# EAGLE design circuit (EAGLE 6.6.0)
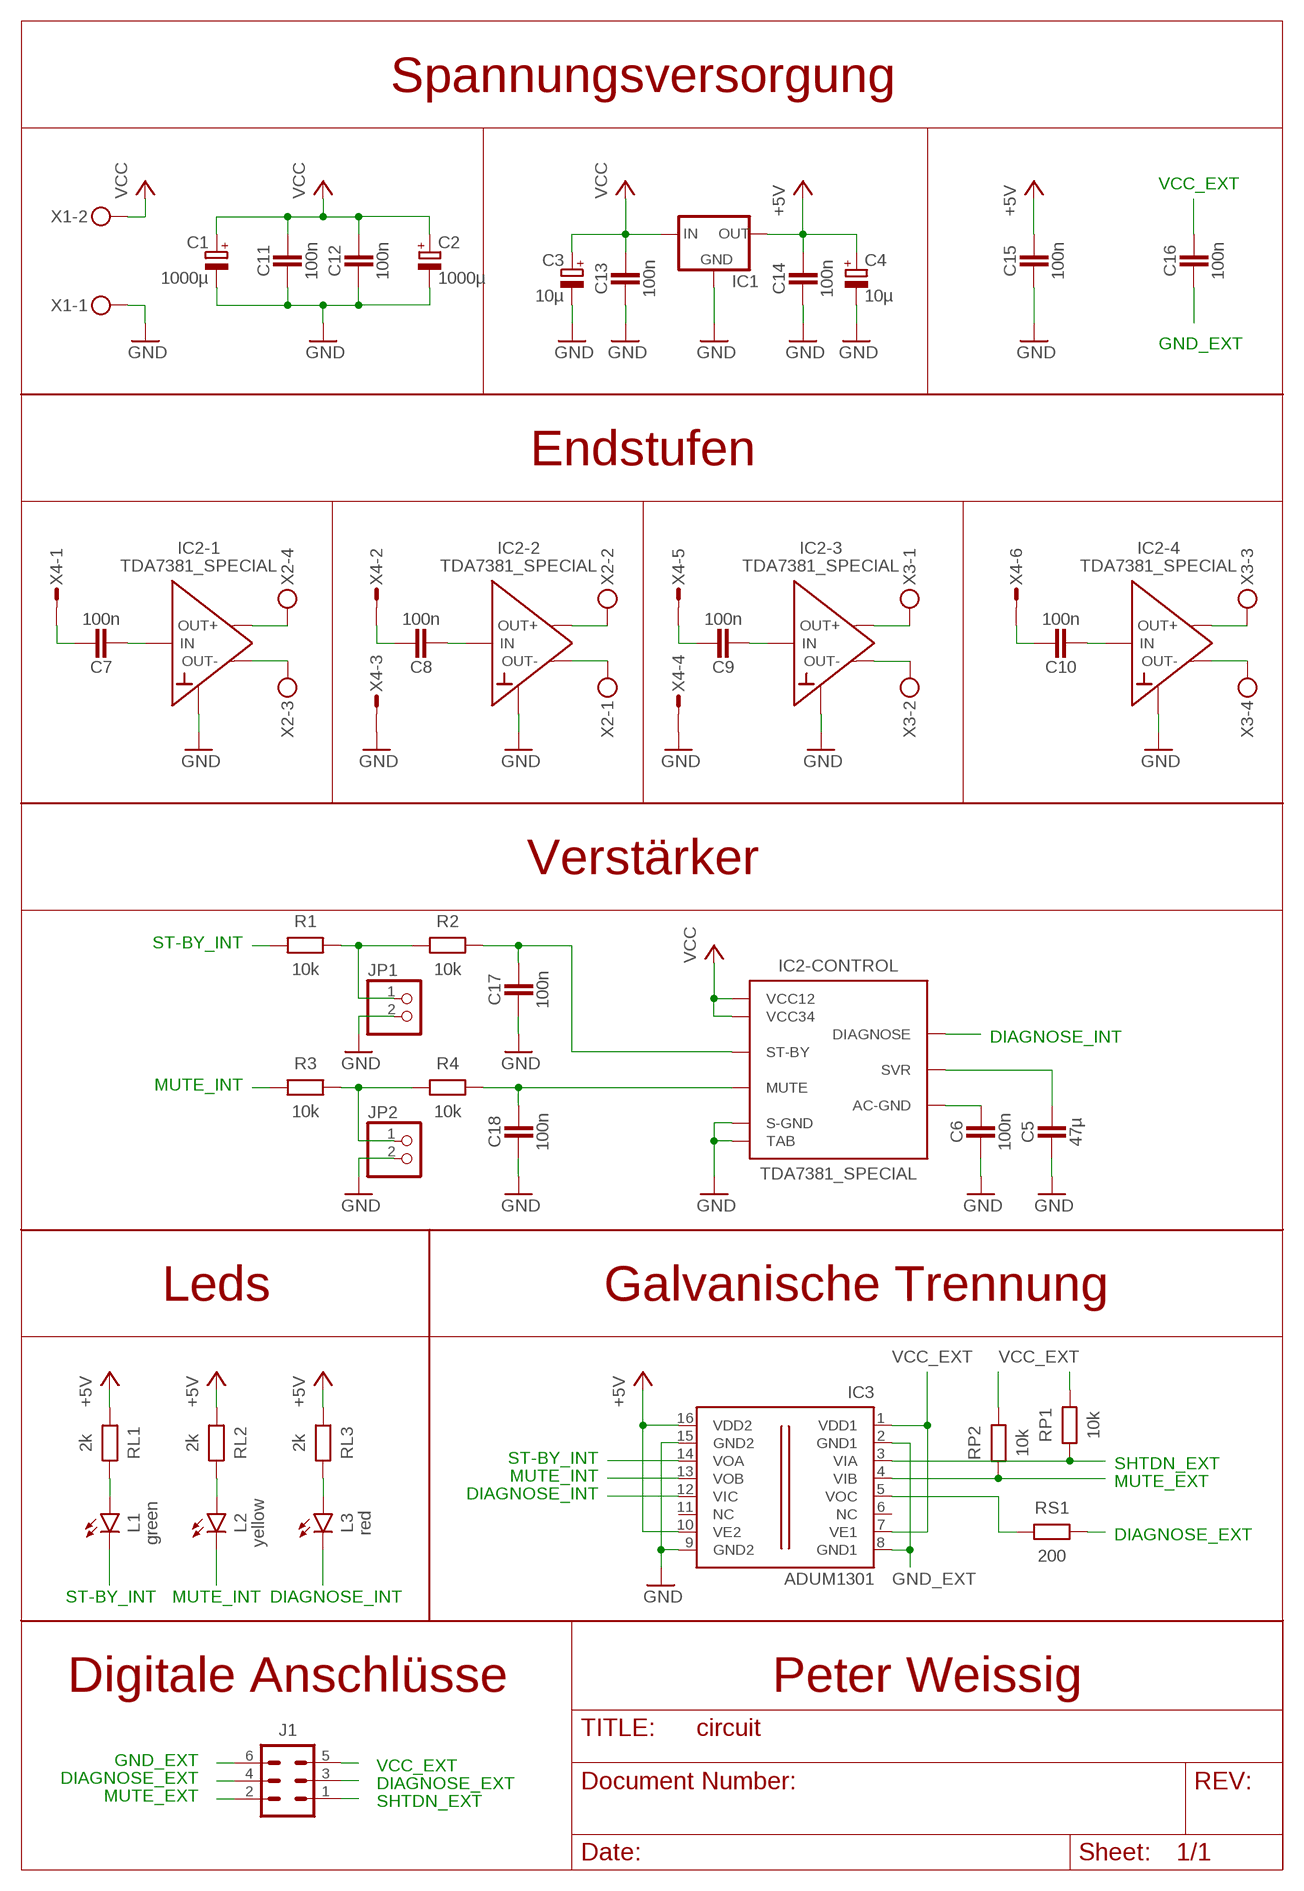
[diagram p0: schematic, sheet 1]

## Parts
C1  1000µ  CPOL-EUE5-10.5  [E5-10,5]
C2  1000µ  CPOL-EUE5-10.5  [E5-10,5]
C3  10µ  CPOL-EUE2-5  [E2-5]
C4  10µ  CPOL-EUE2-5  [E2-5]
C5  47µ  CAPACITATOR-2312S  [SMD_2312S]
C6  100n  CAPACITATOR-1206  [SMD_1206]
C7  100n  CAPACITATOR-5MM  [C_THT_3]
C8  100n  CAPACITATOR-5MM  [C_THT_3]
C9  100n  CAPACITATOR-5MM  [C_THT_3]
C10  100n  CAPACITATOR-5MM  [C_THT_3]
C11  100n  CAPACITATOR-1206  [SMD_1206]
C12  100n  CAPACITATOR-1206  [SMD_1206]
C13  100n  CAPACITATOR-1206  [SMD_1206]
C14  100n  CAPACITATOR-1206  [SMD_1206]
C15  100n  CAPACITATOR-1206  [SMD_1206]
C16  100n  CAPACITATOR-1206  [SMD_1206]
C17  100n  CAPACITATOR-5MM  [C_THT_3]
C18  100n  CAPACITATOR-5MM  [C_THT_3]
IC1  78XXS  [78XXS]
IC2  TDA7381_SPECIAL  [IC_FLEXIWATT25_SPECIAL]
IC3  ADUM1301  [SO-16W]
J1  STECKER_WANNE_6  [STECKER_WANNE_6]
JP1  PINHD-1X2  [1X02]
JP2  PINHD-1X2  [1X02]
L1  green  LED-3MM  [LED_3MM]
L2  yellow  LED-3MM  [LED_3MM]
L3  red  LED-3MM  [LED_3MM]
R1  10k  RESISTOR-1206  [SMD_1206]
R2  10k  RESISTOR-1206  [SMD_1206]
R3  10k  RESISTOR-1206  [SMD_1206]
R4  10k  RESISTOR-1206  [SMD_1206]
RL1  2k  RESISTOR-1206  [SMD_1206]
RL2  2k  RESISTOR-1206  [SMD_1206]
RL3  2k  RESISTOR-1206  [SMD_1206]
RP1  10k  RESISTOR-1206  [SMD_1206]
RP2  10k  RESISTOR-1206  [SMD_1206]
RS1  200  RESISTOR-1206  [SMD_1206]
X1  STECKER_SPG_2  [STECKER_SPG_2]
X2  STECKER_SPG_4  [STECKER_SPG_4]
X3  STECKER_SPG_4  [STECKER_SPG_4]
X4  STECKER_MICROMATCH_6  [STECKER_MICROMATCH_6]

## Nets
+5V: C4.+ C14.1 C15.1 IC1.OUT IC3.10(VE2) IC3.16(VDD2) RL1.2 RL2.2 RL3.2
DIAGNOSE_EXT: J1.3 J1.4 RS1.2
DIAGNOSE_INT: IC2.25(-CONTROL:DIAGNOSE) IC3.12(VIC) L3.K(C)
GND: C1.- C2.- C3.- C4.- C5.2 C6.2 C11.2 C12.2 C13.2 C14.2 C15.2 C17.1 C18.1 IC1.GND IC2.1(-CONTROL:TAB) IC2.2(-2:GND) IC2.8(-1:GND) IC2.13(-CONTROL:S-GND) IC2.18(-3:GND) IC2.24(-4:GND) IC3.9(GND2) IC3.15(GND2) JP1.2 JP2.2 X1.1 X4.3 X4.4
GND_EXT: C16.2 IC3.2(GND1) IC3.8(GND1) J1.6
MUTE: C18.2 IC2.22(-CONTROL:MUTE) R4.2
MUTE_EXT: IC3.4(VIB) J1.2 RP2.1
MUTE_INT: IC3.13(VOB) L2.K(C) R3.1
N$4: C7.2 IC2.11(-1:IN)
N$5: C7.1 X4.1
N$6: C8.1 X4.2
N$7: C8.2 IC2.12(-2:IN)
N$8: C9.1 X4.5
N$9: C10.1 X4.6
N$10: C9.2 IC2.15(-3:IN)
N$13: C10.2 IC2.14(-4:IN)
N$14: JP1.1 R1.2 R2.1
N$16: C5.1 IC2.10(-CONTROL:SVR)
N$17: C6.1 IC2.16(-CONTROL:AC-GND)
N$19: L3.A RL3.1
N$34: L1.A RL1.1
N$35: JP2.1 R3.2 R4.1
N$36: L2.A RL2.1
N$37: IC3.5(VOC) RS1.1
OUT1+: IC2.9(-1:OUT+) X2.4
OUT1-: IC2.7(-1:OUT-) X2.3
OUT2+: IC2.5(-2:OUT+) X2.2
OUT2-: IC2.3(-2:OUT-) X2.1
OUT3+: IC2.17(-3:OUT+) X3.1
OUT3-: IC2.19(-3:OUT-) X3.2
OUT4+: IC2.21(-4:OUT+) X3.3
OUT4-: IC2.23(-4:OUT-) X3.4
SHTDN_EXT: IC3.3(VIA) J1.1 RP1.1
ST-BY: C17.2 IC2.4(-CONTROL:ST-BY) R2.2
ST-BY_INT: IC3.14(VOA) L1.K(C) R1.1
VCC: C1.+ C2.+ C3.+ C11.1 C12.1 C13.1 IC1.IN IC2.6(-CONTROL:VCC12) IC2.20(-CONTROL:VCC34) X1.2
VCC_EXT: C16.1 IC3.1(VDD1) IC3.7(VE1) J1.5 RP1.2 RP2.2
Unconnected: IC3.6(NC) IC3.11(NC)

## Notes on the sheet
- Spannungsversorgung
- Endstufen
- Verstärker
- Leds | Galvanische Trennung
- Digitale Anschlüsse | Peter Weissig

## Library data of the parts
C1-C4 = rcl:CPOL-EU: POLARIZED CAPACITOR, European symbol
C5-C18 = robo_ag:CAPACITATOR: Kondensator
IC1 = v-reg:78XXS: VOLTAGE REGULATOR
IC2 = robo_ag:TDA7381: Audioverstaerker Reichelt:TDA 7381 4x25W 14,4V
IC3 = analog-devices:ADUM1301: Triple-Channel Digital Isolators Source: http://www.analog.com/static/imported-files/data_sheets/ADuM1300_1301.pdf; MPN: ADUM1301BRWZ; OC_FARNELL: 1465623; OC_NEWARK: 19M0757
J1 = robo_ag:STECKER_WANNE_6: Wannenstecker Reichelt:WSL 6G 2x3 THT
JP1 JP2 = pinhead:PINHD-1X2: PIN HEADER
L1-L3 = robo_ag:LED: Led Reichelt: LA E67B Variante: PLCC4 560-1400mcd 2,2V; 50mA Gelb-Orange SMD Reichelt: LA E67F Variante: PLCC4_REV 560mcd 2,65V; 50mA Orange SMD
R1-R4 RL1-RL3 RP1 RP2 RS1 = robo_ag:RESISTOR: Widerstand Reichelt: METALL x,xx[k]
X1 = robo_ag:STECKER_SPG_2: Anschlussklemme Reichelt:AKL 101-02 Nicht Anreihbar Reichelt:AKL 057-02 Anreihbar
X2 X3 = robo_ag:STECKER_SPG_4: Anschlussklemme Reichelt:RND 205-00014 Nicht Anreihbar
X4 = robo_ag:STECKER_MICROMATCH_6: MicroMatch 6

## Board
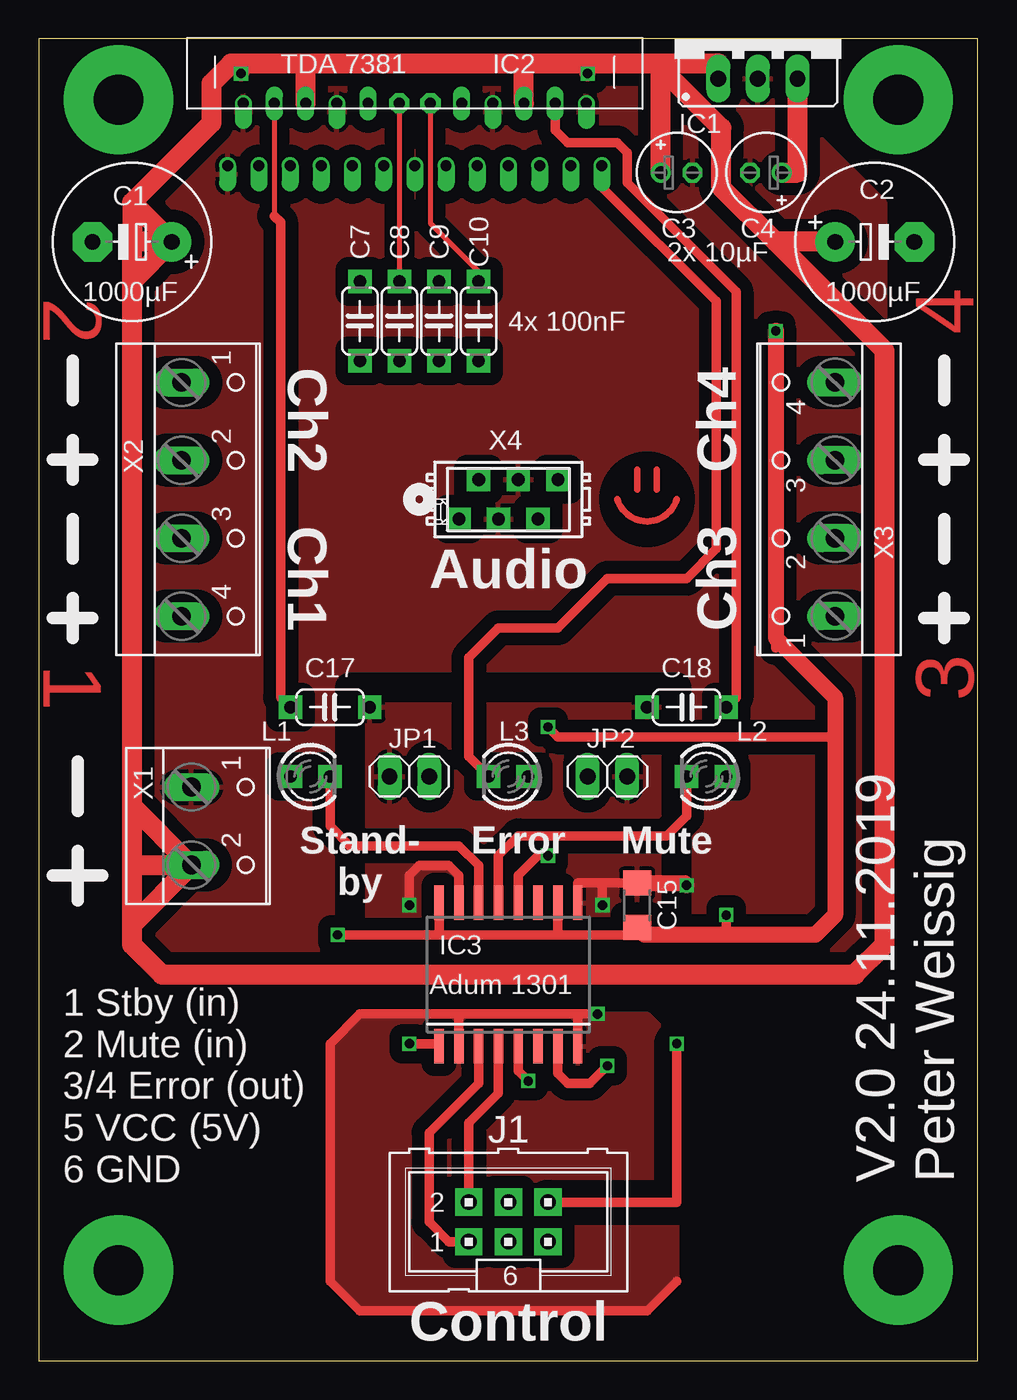
[diagram p1: board, top side]
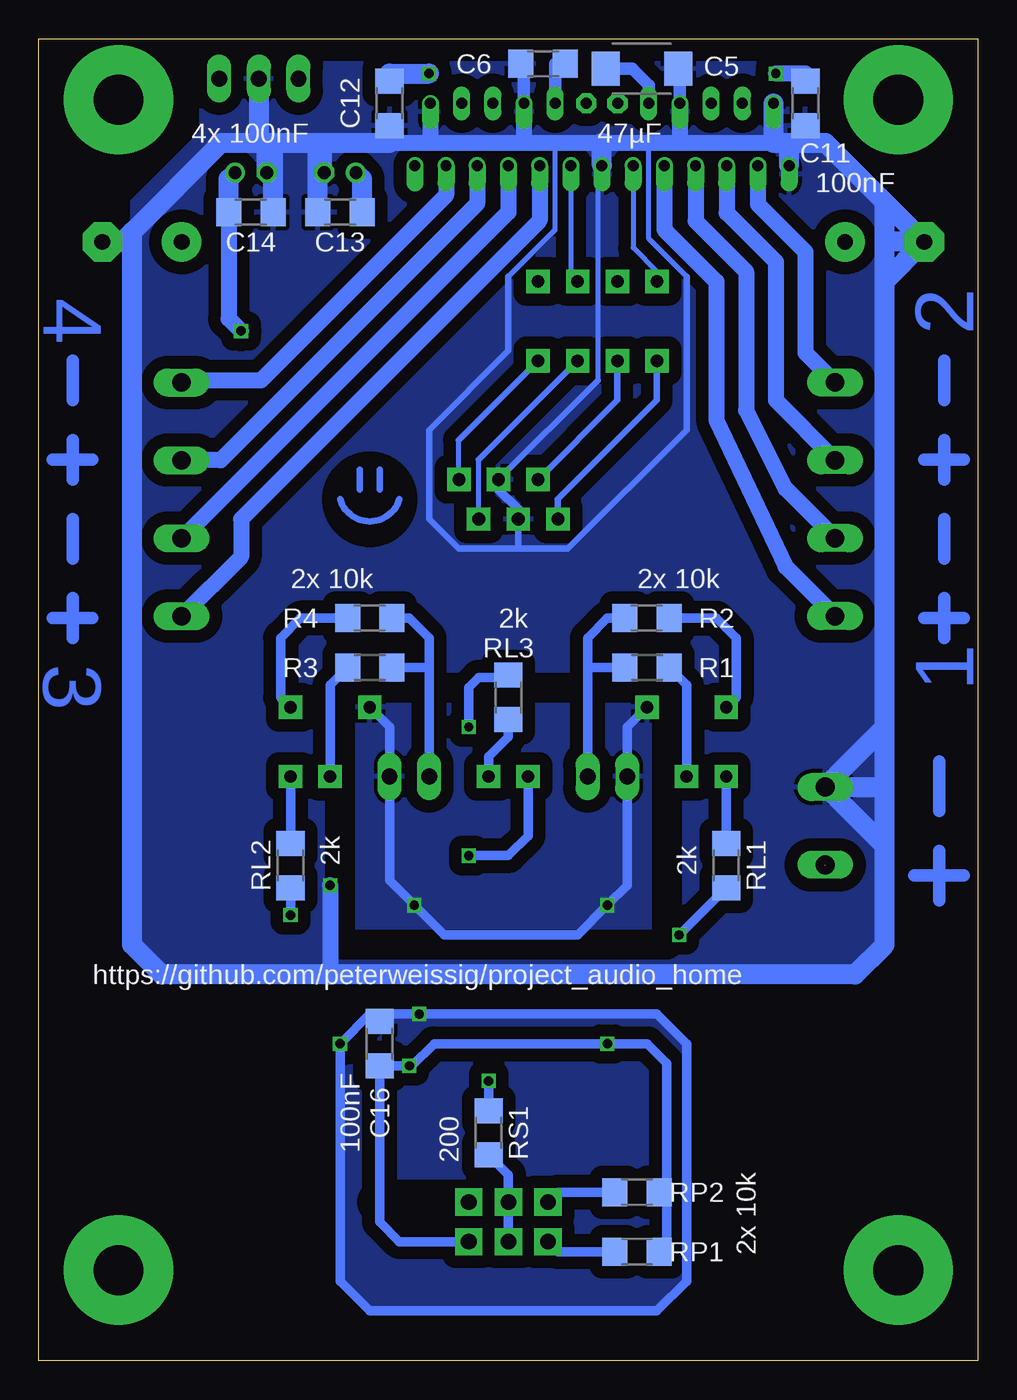
[diagram p2: board, bottom side, seen from below]

Size 60.2 x 84.77 mm. Coordinates in mm from the lower left corner, seen from the top.
Outline: 0,0 60.2,0 60.2,84.77 0,84.77 0,0
Copper layers (1*16): Top 0.035mm / dielectric 1.6mm / Bottom 0.035mm
Design rules "Elecrow_2-layer_PCB_eagle_rule": minimum track width 6mil, minimum drill 12mil, track to track 6mil, track to pad 6mil, pad to pad 6mil, via to via 8mil, smd to smd 0mil, copper to edge 20mil, drill to drill 10mil, minimum pad ring 6mil, minimum via ring 6mil, stop-mask expansion 0mil, vias tented up to drill 100mil, thermal gap 10mil
tRestrict: area 37,53.2 to 41,57.3; 6 lines
bRestrict: area 37,53.2 to 41,57.3; 6 lines

### Footprints (pad centres in the part's own frame; a part is rotated, then mirrored left to right if it is on the bottom)
E5-10,5 = drill 1.016 pad 2.54: + -2.54,0 | drill 1.016 pad 2.54 octagon: - 2.54,0
E2-5 = drill 0.813 pad 1.27: + -1.016,0 | drill 0.813 pad 1.27 octagon: - 1.016,0
SMD_2312S = smd 1.8 x 2.2: 1 -2.322,0; 2 2.322,0
SMD_1206 = smd 1.6 x 1.803: 1 -1.422,0; 2 1.422,0
C_THT_3 = drill 0.8 pad 1.5 square: 1 -2.54,0; 2 2.54,0
78XXS = drill 1.016 long: GND 0,-2.54; IN -2.54,-2.54; OUT 2.54,-2.54
IC_FLEXIWATT25_SPECIAL = drill 0.7 pad 1.1 offset: 1 -12,-4; 2 -11,0; 3 -10,-4; 5 -8,-4; 7 -6,-4; 8 -5,0; 9 -4,-4; 11 -2,-4; 13 0,-4; 15 2,-4; 17 4,-4; 18 5,0; 19 6,-4; 21 8,-4; 23 10,-4; 24 11,0; 25 12,-4 | drill 0.7 pad 1.1 long: 4 -9,0; 6 -7,0; 10 -3,0; 16 3,0; 20 7,0; 22 9,0 | drill 0.7 pad 1.3 octagon: 12 -1,0; 14 1,0
SO-16W = smd 0.6 x 2.2: 1 -4.445,-4.6; 2 -3.175,-4.6; 3 -1.905,-4.6; 4 -0.635,-4.6; 5 0.635,-4.6; 6 1.905,-4.6; 7 3.175,-4.6; 8 4.445,-4.6; 9 4.445,4.6; 10 3.175,4.6; 11 1.905,4.6; 12 0.635,4.6; 13 -0.635,4.6; 14 -1.905,4.6; 15 -3.175,4.6; 16 -4.445,4.6
STECKER_WANNE_6 = drill 1 pad 1.75 square: 1 -2.54,-1.27; 2 -2.54,1.27; 3 0,-1.27; 4 0,1.27; 5 2.54,-1.27; 6 2.54,1.27
1X02 = drill 1.016 long: 1 -1.27,0; 2 1.27,0
LED_3MM = drill 0.8 pad 1.5 square: A -1.27,0; K 1.27,0
STECKER_SPG_2 = drill 1.194 long: 1 -2.5,-1.27; 2 2.5,-1.27
STECKER_SPG_4 = drill 1.194 long: 1 -7.5,-1.27; 2 -2.5,-1.27; 3 2.5,-1.27; 4 7.5,-1.27
STECKER_MICROMATCH_6 = drill 0.813 pad 1.5 square: 1 3.175,1.27; 2 1.905,-1.27; 3 0.635,1.27; 4 -0.635,-1.27; 5 -1.905,1.27; 6 -3.175,-1.27

### Placement (x,y rotation side)
C1  5.97,71.75 180 top
C2  53.59,71.75 0 top
C3  40.89,76.2 0 top
C4  46.61,76.2 180 top
C5  21.53,82.87 0 bottom
C6  27.88,83.19 180 bottom
C7  20.57,66.67 90 top
C8  23.11,66.67 90 top
C9  25.65,66.67 90 top
C10  28.19,66.67 90 top
C11  11.05,80.64 270 bottom
C12  37.72,80.64 270 bottom
C13  40.89,73.66 180 bottom
C14  46.61,73.66 0 bottom
C15  38.35,29.21 90 top
C16  38.35,20.32 90 bottom
C17  18.67,41.91 180 top
C18  41.53,41.91 0 top
IC1  46.1,84.77 0 top
IC2  24.1,80.64 0 top
IC3  30.1,24.77 0 top
J1  30.1,8.89 0 top
JP1  23.75,37.46 180 top
JP2  36.45,37.46 0 top
L1  17.4,37.46 0 top
L2  42.8,37.46 180 top
L3  30.1,37.46 180 top
R1  21.21,44.45 180 bottom
R2  21.21,47.62 0 bottom
R3  38.99,44.45 0 bottom
R4  38.99,47.62 180 bottom
RL1  16.13,31.75 270 bottom
RL2  44.07,31.75 270 bottom
RL3  30.1,42.55 90 bottom
RP1  21.84,6.99 0 bottom
RP2  21.84,10.79 0 bottom
RS1  31.37,14.61 270 bottom
X1  11.05,34.29 270 top
X2  10.41,55.24 270 top
X3  49.78,55.24 90 top
X4  30.1,55.24 180 top

### Tracks (layer width: path | path; a pad name or v marks a point on that pad's centre or on a via)
+5V  (via drill 0.6)
  Top 0.61: IC3.16 25.65,27.3 | 25.65,27.3 33.27,27.3 | 33.27,27.3 IC3.10 | C15.1 38.35,27.3 33.27,27.3 | v19.15,27.3 25.65,27.3 | 47.24,45.72 47.24,46.35 | v44.07,28.58 44.07,27.3 | v32.64,40.64 33.27,40 51.05,40
  Top 1.016: v47.24,66.04 47.24,46.35 51.05,42.55 51.05,40 51.05,28.58 49.78,27.3 44.07,27.3 38.84,27.3 C15.1
  Top 1.27: C4.+ 48.64,76.2 IC1.OUT
  Bottom 0.61: RL1.2 v19.15,27.3 | RL2.2 v44.07,28.58 | v32.64,40.64 32.64,43.18 32,43.81 30.25,43.81 RL3.2
  Bottom 1.016: C14.1 48.03,66.83 v47.24,66.04
  Bottom 1.27: C14.1 48.03,75.79 C4.+
DIAGNOSE_EXT
  Bottom 0.61: J1.3 J1.4 30.1,11.91 RS1.2
DIAGNOSE_INT  (via drill 0.6)
  Top 0.61: IC2.25 36.1,75.28 43.43,67.95 43.43,52.07 41.53,50.16 36.45,50.16 33.27,46.99 29.46,46.99 27.56,45.09 27.56,38.73 L3.K | IC3.12 30.73,31.12 32,32.38 v32.64,32.38
  Bottom 0.61: v32.64,32.38 30.1,32.38 28.83,33.66 L3.K
GND  (via drill 0.6)
  Top 0.406: IC3.9 34.54,29.06
  Top 0.61: IC3.9 34.54,30.63 36.13,30.63 | 36.13,30.63 C15.2 | IC3.15 26.92,31.12 26.29,31.75 24.38,31.75 23.75,31.12 v23.75,29.21 | v36.13,29.21 36.13,30.63
  Top 1.016: C15.2 41.38,30.63 v41.53,30.48
  Bottom 0.305: IC2.13 24.38,76.36 24.38,62.86 | 18.67,69.53 21.11,71.97 21.11,78.11 21.84,78.11 | 26.92,78.11 27.1,78.11 27.1,72.53 30.1,69.53
  Bottom 0.406: 24.38,62.86 X4.4 | 18.67,69.53 18.67,59.69 26.29,52.07 29.46,52.07 | 29.46,52.07 33.27,52.07 35.18,53.98 35.18,59.69 30.1,64.77 30.1,69.53 | X4.3 29.46,52.07
  Bottom 0.61: X4.4 30.73,55.88 29.46,54.61 X4.3 | C18.1 37.72,40.64 JP2.2 37.72,30.8 v36.13,29.21 34.23,27.3 25.65,27.3 v23.75,29.21 22.48,30.48 JP1.2 22.48,40.64 C17.1
  Bottom 0.813: IC2.8 19.1,82.87 C5.2 | IC2.18 29.1,83.19 C6.2
  Bottom 1.016: IC2.8 19.1,78.11 | 19.1,78.11 13.1,78.11 | IC2.18 29.1,78.11 | 29.1,78.11 26.92,78.11 24.1,78.11 21.84,78.11 19.1,78.11 | IC2.24 35.1,78.11 | 35.1,78.11 29.1,78.11 | 37.72,78.11 35.1,78.11 | C3.- 41.91,78.11 | C11.2 11.05,78.11 12.32,78.11 | 45.19,77.95 45.34,78.11 | 42.32,77.95 42.16,78.11 | v41.53,30.48 41.53,24.77
  Bottom 1.27: 5.97,33.02 5.97,26.67 7.87,24.77 41.53,24.77 52.32,24.77 54.23,26.67 54.23,72.39 | 5.97,33.02 5.97,36.83 | 5.97,36.83 5.97,40.64 | 5.97,40.64 5.97,69.22 | 5.97,69.22 5.97,71.75 | 5.97,71.75 5.97,74.3 | 5.97,74.3 9.78,78.11 11.05,78.11 12.1,78.11 | C1.- 5.97,71.75 | IC2.1 12.1,78.11 | IC2.2 13.1,78.11 12.32,78.11 12.1,78.11 | C1.- 5.97,74.3 | C1.- 5.97,69.22 | IC1.GND 46.1,78.11 | 46.1,78.11 45.59,78.11 | 45.59,78.11 45.34,78.11 42.16,78.11 41.91,78.11 37.72,78.11 C12.2 | C4.- 45.59,78.11 | 46.1,78.11 48.51,78.11 54.23,72.39 | C2.- 54.86,71.75 54.23,72.39 | C14.2 45.19,77.95 | C13.2 42.32,77.95 | IC2.13 24.1,78.11 | X1.1 6.01,36.79 5.97,36.83 | 5.97,33.02 9.78,36.83 5.97,40.64
  pour Top (isolate 0.813): 7.87,24.77 5.97,26.67 5.97,74.3 11.05,79.38 11.05,81.91 12.32,83.19 48.51,83.19 49.78,81.91 49.78,78.74 54.23,74.3 54.23,26.67 52.32,24.77
  pour Bottom (isolate 0.813): 7.87,24.77 5.97,26.67 5.97,74.3 11.05,79.38 11.05,81.91 12.32,83.19 48.51,83.19 49.78,81.91 49.78,78.74 54.23,74.3 54.23,26.67 52.32,24.77
GND_EXT  (via drill 0.6)
  Top 0.406: IC3.8
  Top 0.61: IC3.2 26.92,22.23 | 26.92,22.23 34.54,22.23 | 34.54,22.23 v35.81,22.23 | IC3.8 34.54,22.23 | v40.89,20.32 40.89,10.16 J1.6 | 26.92,22.23 20.57,22.23 18.67,20.32 18.67,5.08 20.57,3.17 38.99,3.17 40.89,5.08
  Bottom 0.61: 37.87,22.23 C16.2 38.35,22.23 | 38.35,22.23 38.99,22.23 v40.89,20.32 40.89,5.08 38.99,3.17 20.57,3.17 18.67,5.08 18.67,20.32 20.57,22.23 v35.81,22.23 38.35,22.23
  pour Bottom (isolate 0.813): 18.67,20.32 20.57,22.23 38.99,22.23 40.89,20.32 40.89,5.08 38.99,3.17 20.57,3.17 18.67,5.08
  pour Top (isolate 0.813): 18.67,20.32 20.57,22.23 38.99,22.23 40.89,20.32 40.89,5.08 38.99,3.17 20.57,3.17 18.67,5.08
MUTE
  Top 0.61: IC2.22 33.1,78.91 33.91,78.11 37.08,78.11 37.72,77.47 37.72,75.56 44.7,68.58 44.7,42.55 C18.2
  Bottom 0.61: R4.2 43.43,47.62 44.7,46.35 44.7,42.55 C18.2
MUTE_EXT
  Top 0.61: IC3.4 29.46,17.14 27.56,15.24 J1.2
  Bottom 0.61: RP2.1 26.92,10.79 J1.2
MUTE_INT
  Top 0.61: IC3.13 29.46,32.38 30.73,33.66 40.26,33.66 41.53,34.92 L2.K
  Bottom 0.61: L2.K 41.53,43.33 R3.1
N$1  (via drill 3.2 pad 7)
  other vias: 5.1,5.8
N$2
  Bottom 0.406: 38.35,57.15 38.35,55.88
N$3
  Bottom 0.813: 58.04,64.14 58.04,61.59
N$4
  Bottom 0.305: IC2.11 22.1,71.38 20.57,69.85 C7.2
N$5
  Bottom 0.406: C7.1 20.57,61.59 26.92,55.24 X4.1
N$6
  Bottom 0.406: X4.2 23.11,61.59 C8.1
N$7
  Top 0.305: IC2.12 C8.2
N$8
  Bottom 0.305: X4.5 32,57.78
  Bottom 0.406: 32,57.78 C9.1
N$9
  Bottom 0.305: X4.6 33.27,59.05
  Bottom 0.406: 33.27,59.05 C10.1
N$10
  Bottom 0.305: IC2.15 26.1,69.66 C9.2
N$11  (via drill 3.2 pad 7)
  other vias: 5.1,80.88
N$12  (via drill 3.2 pad 7)
  other vias: 55.1,5.8
N$13
  Top 0.305: IC2.14 25.1,72.94 28.19,69.85 C10.2
N$14
  Bottom 0.61: JP1.1 25.02,44.45 | 25.02,44.45 25.02,46.35 23.75,47.62 R2.1 | R1.2 25.02,44.45
N$15
  Top 0.813: 3.43,57.78 2.16,57.78 | 2.16,57.78 0.89,57.78 | 2.16,57.78 2.16,56.52 | 2.16,59.05 2.16,57.78
N$16
  Bottom 0.813: IC2.10 21.1,81.8 22.16,82.87 C5.1
N$17
  Bottom 0.813: IC2.16 27.1,83.19 C6.1
N$18
  Top 0.813: 2.16,64.14 2.16,61.59
N$19
  Bottom 0.61: L3.A 31.37,38.73 30.1,40 RL3.1
N$20
  Bottom 0.813: 0.89,47.62 2,47.62 2.16,47.62 | 2.16,47.62 3.43,47.62 | 2.16,47.62 2.16,46.35 | 2.16,48.89 2.16,47.62
N$21
  Bottom 0.406: 39.62,57.15 39.62,55.88
N$22
  Bottom 0.813: 56.77,57.78 58,57.78 58.04,57.78 | 58.04,57.78 59.31,57.78 | 58.04,57.78 58.04,56.52 | 58.04,59.05 58.04,57.78
N$23
  Bottom 0.406: 40.89,55.24 arc-146 37.08,55.24
N$24
  Top 0.406: 39.62,57.15 39.62,55.88
N$25
  Bottom 0.813: 58.04,47.62 58.04,46.35 | 56.77,47.62 58,47.62 58.04,47.62 | 58.04,47.62 59.31,47.62 | 58.04,48.89 58.04,47.62
N$26
  Bottom 0.813: 2.48,38.42 2.48,35.24
N$27
  Bottom 0.813: 2.48,31.12 2.48,29.53 | 4.06,31.12 3,31.12 2.48,31.12 | 2.48,31.12 0.89,31.12 | 2.48,32.7 2.48,31.12
N$28
  Top 0.406: 38.35,57.15 38.35,55.88
N$29
  Bottom 0.813: 2.16,57.78 2.16,56.52 | 0.89,57.78 2,57.78 2.16,57.78 | 2.16,57.78 3.43,57.78 | 2.16,59.05 2.16,57.78
N$30
  Bottom 0.813: 2.16,64.14 2.16,61.59
N$31
  Bottom 0.813: 2.16,53.98 2.16,51.43
N$32
  Bottom 0.813: 58.04,53.98 58.04,51.43
N$33
  Top 0.813: 2.16,53.98 2.16,51.43
N$34
  Bottom 0.61: RL1.1 L1.A
N$35
  Bottom 0.61: JP2.1 35.18,44.45 | 35.18,44.45 35.18,46.35 36.45,47.62 R4.1 | R3.2 35.18,44.45
N$36
  Bottom 0.61: RL2.1 L2.A
N$37  (via drill 0.6)
  Top 0.61: IC3.5 30.73,18.57 v31.37,17.93
  Bottom 0.61: RS1.1 v31.37,17.93
N$38
  Top 0.406: 37.08,55.24 arc146 40.89,55.24
N$40
  Top 0.813: 2.16,47.62 2.16,46.35 | 3.43,47.62 2.16,47.62 | 2.16,47.62 0.89,47.62 | 2.16,48.89 2.16,47.62
N$41
  Top 0.813: 58.04,53.98 58.04,51.43
N$42
  Top 0.813: 58.04,64.14 58.04,61.59
N$43
  Top 0.813: 59.31,57.78 58.04,57.78 | 58.04,57.78 56.77,57.78 | 58.04,57.78 58.04,56.52 | 58.04,59.05 58.04,57.78
N$45
  Top 0.813: 59.31,47.62 58.04,47.62 | 58.04,47.62 56.77,47.62 | 58.04,47.62 58.04,46.35 | 58.04,48.89 58.04,47.62
N$47
  Top 0.813: 2.48,38.42 2.48,35.24
N$49
  Top 0.813: 4.06,31.12 2.48,31.12 | 0.89,31.12 2.16,31.12 2.48,31.12 | 2.48,31.12 2.48,29.53 | 2.48,32.7 2.48,31.12
N$1001  (via drill 3.2 pad 7)
  other vias: 55.1,80.88
OUT1+
  Bottom 1.016: IC2.9 20.1,72.55 16.76,69.22 16.76,60.32 12.32,50.92 X2.4
OUT1-
  Bottom 1.016: IC2.7 18.1,73.09 14.86,69.85 14.86,60.96 12.32,55.92 X2.3
OUT2+
  Bottom 1.016: IC2.5 16.1,73.63 12.95,70.48 12.95,61.59 X2.2
OUT2-
  Bottom 1.016: IC2.3 14.1,74.17 11.05,71.12 11.05,64.65 X2.1
OUT3+
  Bottom 1.016: IC2.17 28.1,73.12 47.24,53.98 47.24,51.55 X3.1
OUT3-
  Bottom 1.016: IC2.19 30.1,73.66 51.01,52.74 X3.2
OUT4+
  Bottom 1.016: IC2.21 32.1,74.2 48.55,57.74 X3.3
OUT4-
  Bottom 1.016: IC2.23 34.1,74.74 45.97,62.86 50.93,62.86 X3.4
SHTDN_EXT
  Top 0.61: IC3.3 28.19,17.78 25.02,14.61 25.02,8.89 26.29,7.62 J1.1
  Bottom 0.61: RP1.1 26.92,6.99 J1.1
ST-BY
  Top 0.305: IC2.4 15.1,73.42
  Top 0.61: 15.1,73.42 15.49,73.02 15.49,42.55 C17.2
  Bottom 0.61: R2.2 16.76,47.62 15.49,46.35 15.49,42.55 C17.2
ST-BY_INT
  Top 0.61: IC3.14 28.19,31.75 26.92,33.02 19.94,33.02 18.67,34.29 L1.K
  Bottom 0.61: L1.K 18.67,43.33 R1.1
VCC  (via drill 0.6)  (1 unrouted)
  Top 1.016: 41.78,83.19 41.53,83.19 | 39.88,83.19 40.89,83.19 | v35.18,82.55 35.18,83.19 | v12.95,82.55 12.95,83.19
  Top 1.27: 5.97,27.94 5.97,26.67 7.87,24.77 52.32,24.77 54.23,26.67 54.23,64.77 47.24,71.75 | 5.97,27.94 5.97,31.75 | 5.97,31.75 5.97,35.56 | 5.97,35.56 5.97,69.22 | 5.97,69.22 5.97,71.75 | C1.+ 5.97,71.75 | C1.+ 5.97,69.22 | C1.+ 5.97,74.3 | 5.97,74.3 5.97,71.75 | 5.97,74.3 11.05,79.38 11.05,81.91 12.32,83.19 12.95,83.19 17.1,83.19 | IC2.6 17.1,83.19 | IC2.20 31.1,83.19 | 31.1,83.19 17.1,83.19 | IC1.IN 43.56,83.19 41.53,83.19 40.89,83.19 39.62,83.19 | 39.62,83.19 35.18,83.19 31.1,83.19 | C3.+ 39.88,83.19 | C2.+ 47.24,71.75 | 47.24,71.75 43.75,75.25 43.75,79.06 39.62,83.19 | 9.78,31.75 5.97,31.75 | 9.78,31.75 5.97,35.56 | 9.78,31.75 5.97,27.94
  Bottom 1.016: C11.1 11.05,82.55 v12.95,82.55
  Bottom 1.27: C12.1 37.72,82.55 v35.18,82.55 | C13.1 39.47,75.79 C3.+
VCC_EXT  (via drill 0.6)
  Top 0.61: IC3.7 33.27,18.41 33.91,17.78 35.33,17.78 v36.45,18.9 | v23.75,20.32 25.5,20.32 IC3.1
  Bottom 0.61: 19.94,11.28 19.94,7.47 RP1.2 | RP2.2 19.94,11.28 | 19.94,11.28 19.94,19.05 21.21,20.32 v23.75,20.32 34.86,20.32 36.28,18.9 v36.45,18.9 C16.1 38.35,8.89 37.08,7.62 J1.5

### Text on the board
Top: 2 | 4 | 3 | 1
Bottom: 2 | 4 | 1 | 3
tNames: TDA 7381 | 2x 10µF | 1000µF | 1000µF | 4x 100nF | Ch2 | Ch4 | Audio | Ch1 | Ch3 | Stand- / by | Error | Mute | Adum 1301 | 1 Stby (in) / 2 Mute (in) / 3/4 Error (out) / 5 VCC (5V) / 6 GND | V2.0 24.11.2019 / Peter Weissig | Control
bNames: 47µF | 4x 100nF | 100nF | 2x 10k | 2x 10k | 2k | 2k | 2k | https://github.com/peterweissig/project_audio_home | 200 | 100nF | 2x 10k